# Altium schematic sheet Driver2.SchDoc
size A4; SheetNumber: 4; SheetTotal: 4
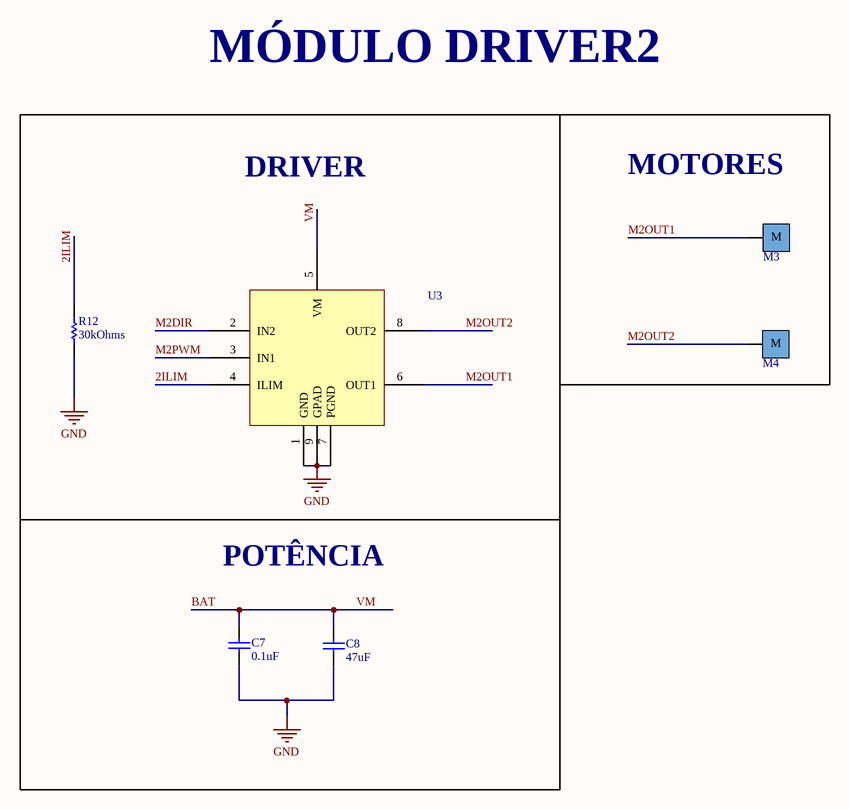
[diagram p0: Driver2.SchDoc]

## Parts
C7  0.1uF  [C0805]
C8  47uF  [C1210]
M3  Motor Pad  [PAD_MOTOR_MINI]  (value not drawn)
M4  Motor Pad  [PAD_MOTOR_MINI]  (value not drawn)
R12  30kOhms  [RESC1608X55N]
U3  DRV8871DDA  [SO-PowerPad-8(8_pins)]  (value not drawn)

## Blocks framed on the sheet
DRIVER: R12 U3

## Nets
GND: C7.1 C8.1 R12.2 U3.1(GND) U3.7(PGND) U3.9(GPAD)
2ILIM: R12.1 U3.4(ILIM)
BAT: C7.2 C8.2 U3.5(VM)  [also labelled VM]
M2DIR: U3.2(IN2)
M2OUT1: M3.M U3.6(OUT1)
M2OUT2: M4.M U3.8(OUT2)
M2PWM: U3.3(IN1)

## Notes on the sheet
- MÓDULO DRIVER2
- MOTORES
- POTÊNCIA

## Library data of the parts
C7 = C0805C104M3RACTU: CAP CER 100nF 25V X7R 0805; Manufacturer: Kemet; Tolerance: 20%; Voltage - Rated: 25 VDC; Library Control - Checked Footprint: Yes; Library Control - Person that Checked Footprint: Cage; Supplier 1: Mouser; Part Number: C0805C104M3RACTU; Category: Ceramic Capacitor; Price: 1=0,13 10=0,064 100=0,037 1000=0,025 (USD); Supplier Part Number 1: 80-C0805C104M3R; Library Ref: Capacitor; Operating Temperature: -55 C ~ 125 C; Package / Case: 0805(2012 mestric); Size / Dimension: 1.25 mm W x 2 mm L x 0.78 mm H; Value: 0.1uF; ESR: -; Dieletric: X7R; Library Control - Checked Schematic: Yes; Library Control - Last Update: 25/08/22; Library Control - Person that Checked Schematic: Cage; Library Control - Person that did the Last Update Footprint: Cage; Library Control - Person that did the Last Update Schematic: Cage; ComponentLink1Description: Datasheet; ComponentLink1URL: https://br.mouser.com/datasheet/2/212/KEM_C1002_X7R_SMD-1102033.pdf; ComponentLink2Description: Mouser Link; ComponentLink2URL: https://br.mouser.com/ProductDetail/KEMET/C0805C104M3RACTU?qs=jbCUrP3sAgSIdMuvv9W4Pg%3D%3D
C8 = GRM32EC81C476KE15K: CAP CER 47uF 16V X6S 1210; Manufacturer: Murata; Tolerance: 10%; Library Control - Checked Footprint: Yes; Library Control - Person that Checked Footprint: Cage; Library Control - Person that did the Last Update Footprint: Prisma; Supplier 1: Mouser; Part Number: GRM32EC81C476KE15K; Category: Ceramic Capacitor; Price: 1=0,59 10=0,314 100=0,274 (USD); Supplier Part Number 1: 81-GRM32EC81C476KE5K; Library Ref: Capacitor; Operating Temperature: -55°C ~ 105°C; Package / Case: 1210 (3225 metric); Size / Dimension: 3.2mm x 2.5mm x 2.5mm; Value: 47uF; Voltage - Rated: 16V; ESR: -; Dieletric: X6S; Library Control - Checked Schematic: Yes; Library Control - Last Update: 22/08/22; Library Control - Person that Checked Schematic: Cage; Library Control - Person that did the Last Update Schematic: Prisma; ComponentLink1Description: Datasheet; ComponentLink1URL: https://br.mouser.com/datasheet/2/281/1/GRM32EC81C476KE15_01A-1988154.pdf; ComponentLink2Description: Mouser Link; ComponentLink2URL: https://br.mouser.com/ProductDetail/Murata-Electronics/GRM32EC81C476KE15K?qs=pba5EUA0Y0ZfNhWUOosFbg%3D%3D
M3 M4 = Motor Pad Mini Sumô: Cable AWG: 20 / 18 (AWG); Recomended Category: Mini Sumô; Size: 3.5 x 3.5 (mm); Library Ref: Pads
R12 = RC0603FR-0730KL: RES SMD 30 kOHMS 1% 1/10W 0603; Manufacturer: YAGEO; Temperature Coefficient: 100 PPM / C; Power Rating: 100 mW (1/10 W); Voltage Rating: 50 V; Library Control - Checked Footprint: Yes; Library Control - Person that Checked Footprint: Guilherme; Supplier 1: Mouser; Part Number: RC0603FR-0730KL; Category: Thick Film Resistors - SMD; Price: 1=0,10, 10=0,024, 100=0,01(USD); Package / Case: 0603 (1608 Metric); Operating Temperature: - 55°C ~ 155°C; Value: 30kOhms; Tolerance: 1 %; Library Ref: Resistor; Resistor Type: Fixo; Size / Dimension: 1,6 L x 0,8 W x 0,45 H; Supplier Part Number 1: 603-RC0603FR-0730KL; Library Control - Checked Schematic: Yes; Library Control - Last Update: 24/07/2021 11:34; Library Control - Person that Checked Schematic: Guilherme; Library Control - Person that did the Last Update Footprint: Guilherme; Library Control - Person that did the Last Update Schematic: Guilherme; ComponentLink1Description: Mouser Link; ComponentLink1URL: https://br.mouser.com/ProductDetail/YAGEO/RC0603FR-0730KL?qs=diQw95jMAeNFr44yr782FQ%3D%3D; ComponentLink2Description: Datasheet; ComponentLink2URL: https://br.mouser.com/datasheet/2/447/Yageo_03_18_2021_PYu_RC_Group_51_RoHS_L_11-2199992.pdf
U3 = DRV8871DDA: IC MTR DRV (6.5V ~ 45V) (3.5 A) SO-PowerPad-8; Manufacturer: Texas Instruments; Suplier Part Number 1: 595-DRV8871DDA; Operating Supply Current: 3mA; Current - Peak Output (Source, Sink): 3.6A / 3.6A; Current - Output: 3.5A; Power Dissipation: Irms^2 (HighSide Rds(On) + LowSide Rds(On)); Output Configuration: Half Bridge (2); Logic Voltage - VIL, VIH: VIL=0.5V / VIH=1.5V; Library Control - Checked Schematic: Yes; Library Control - Person that Checked Schematic: Stéfany (Ster); Library Control - Person that did the Last Update Footprint: Maria Laura; Logic (IN-SD/High Low): IN-SD; Rds On - Drain-Source Resistance: 565m ohm; Category: Driver; Supplier 1: Mouser; Part Number: DRV8871DDA; Price: 1=3,15000, 10=2,84000, 100=2,31000 (USD); Technology: Power MOSFET; Package / Case: SO-PowerPad-8; Voltage - Load: (6.5V ~ 45V); Voltage - Supply: (6.5V ~ 45V); Operating Temperature: -40°C ~ 125°C; Library Ref: Driver; Library Control - Checked Footprint: Yes; Library Control - Last Update: 12/06/2021 17:04; Library Control - Person that Checked Footprint: Stéfany (Ster); Library Control - Person that did the Last Update Schematic: Stéfany (Ster); ComponentLink1Description: Mouser Link / ST Link; ComponentLink1URL: https://br.mouser.com/ProductDetail/Texas-Instruments/DRV8871DDA?qs=Fobv33ltQGiluwfB07aSBw%3D%3D; ComponentLink2Description: Datasheet; ComponentLink2URL: https://www.ti.com/lit/ds/symlink/drv8871.pdf?HQS=dis-mous-null-mousermode-dsf-pf-null-wwe&ts=1623013148488&ref_url=https%253A%252F%252Fwww.google.com%252F